# EAGLE schematic auto_band_pass_filter (EAGLE 9.6.2)
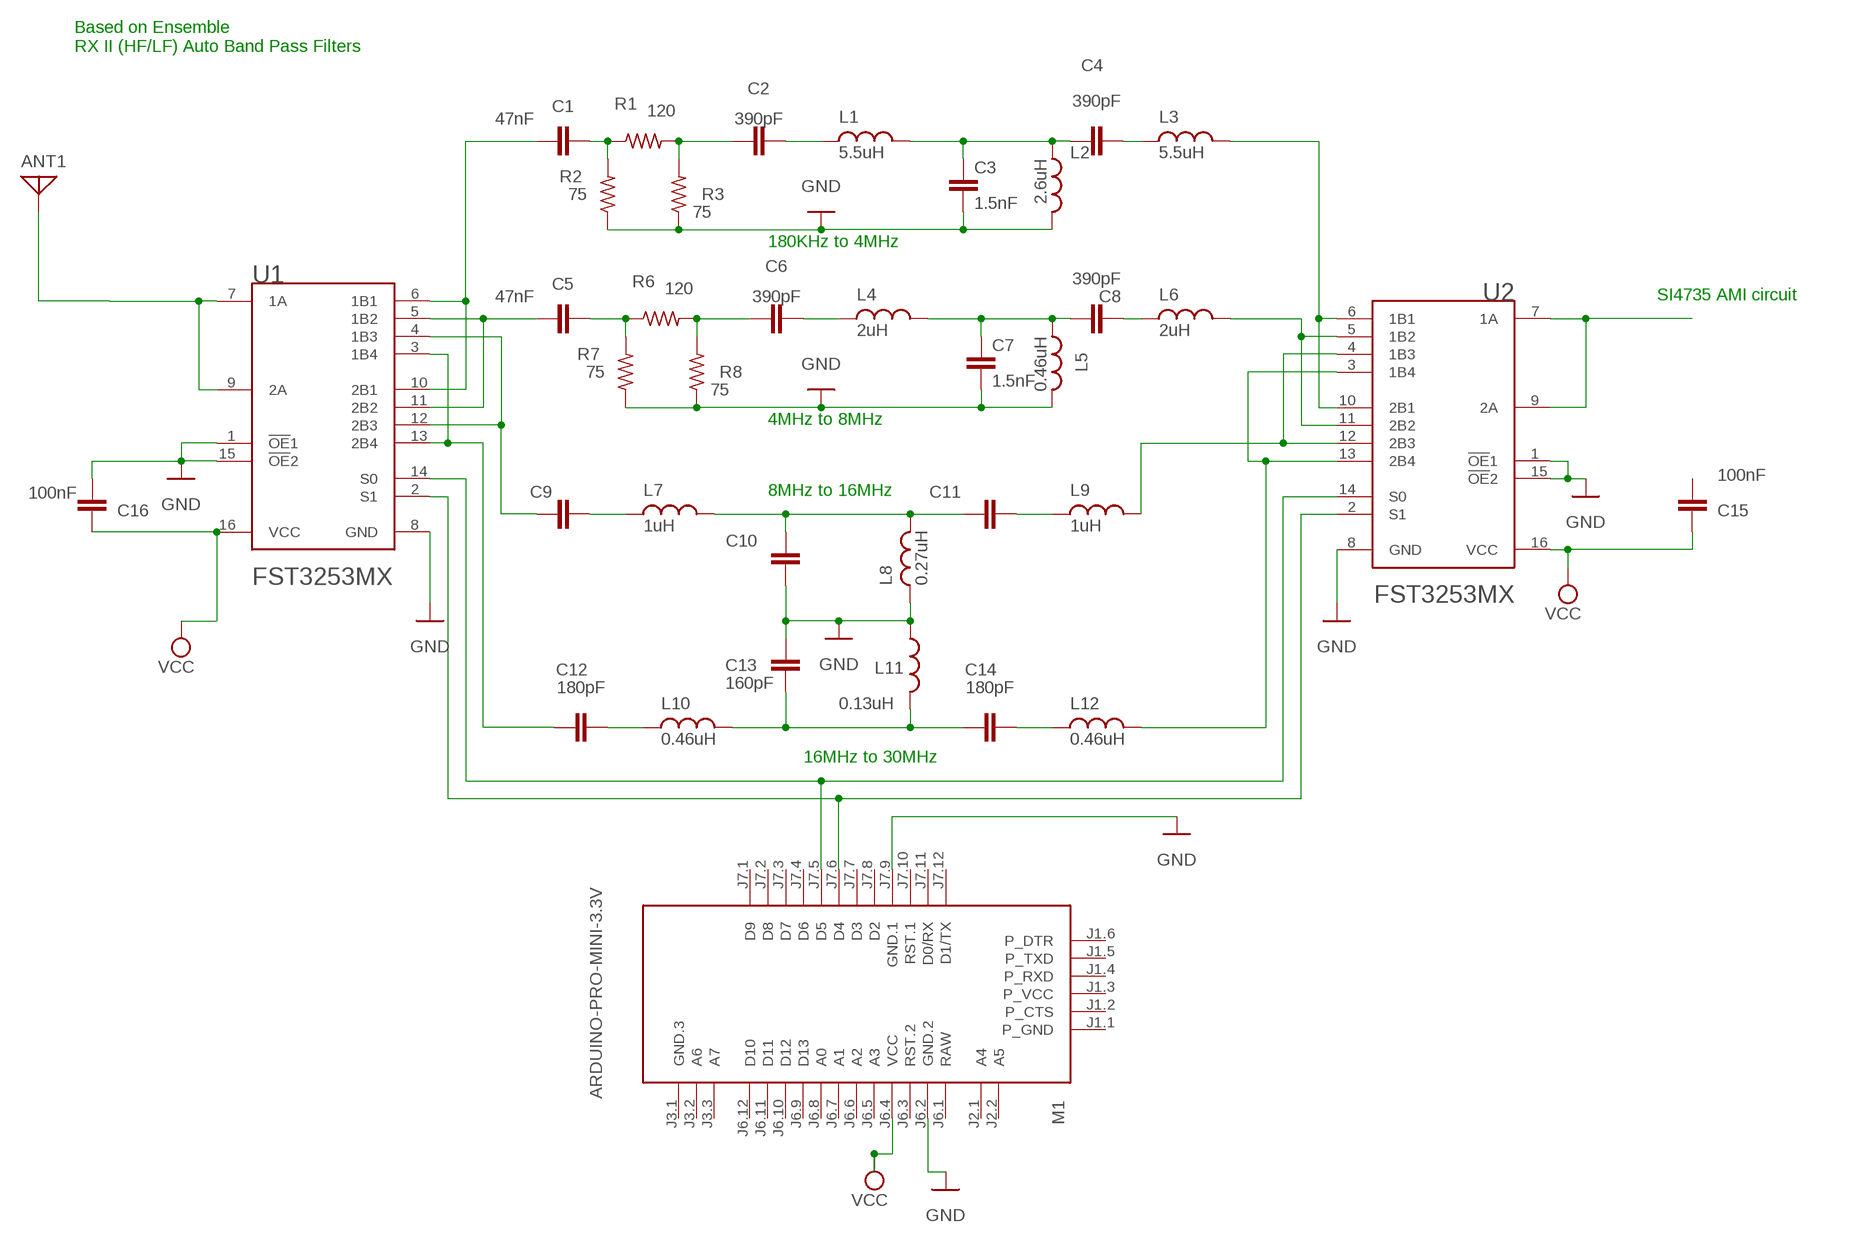
[diagram p0: schematic, sheet 1]

## Parts
ANT1  ANTENNA  [PAD-01]
C1  47nF  C2,5-3  [C2.5-3]
C2  390pF  C2,5-3  [C2.5-3]
C3  1.5nF  C2,5-3  [C2.5-3]
C4  390pF  C2,5-3  [C2.5-3]
C5  47nF  C2,5-3  [C2.5-3]
C6  390pF  C2,5-3  [C2.5-3]
C7  1.5nF  C2,5-3  [C2.5-3]
C8  390pF  C2,5-3  [C2.5-3]
C9  C2,5-3  [C2.5-3]
C10  C2,5-3  [C2.5-3]
C11  C2,5-3  [C2.5-3]
C12  180pF  C2,5-3  [C2.5-3]
C13  160pF  C2,5-3  [C2.5-3]
C14  180pF  C2,5-3  [C2.5-3]
C15  100nF  C2,5-3  [C2.5-3]
C16  100nF  C2,5-3  [C2.5-3]
L1  5.5uH  L  (no package)
L2  2.6uH  L  (no package)
L3  5.5uH  L  (no package)
L4  2uH  L  (no package)
L5  0.46uH  L  (no package)
L6  2uH  L  (no package)
L7  1uH  L  (no package)
L8  0.27uH  L  (no package)
L9  1uH  L  (no package)
L10  0.46uH  L  (no package)
L11  0.13uH  L  (no package)
L12  0.46uH  L  (no package)
M1  ARDUINO-PRO-MINI-3.3V  [ARDUINO-PRO-MINI]
R1  120  R-US_AXIAL-7.2MM-PITCH  [RESAD724W46L381D178B]
R2  75  R-US_AXIAL-7.2MM-PITCH  [RESAD724W46L381D178B]
R3  75  R-US_AXIAL-7.2MM-PITCH  [RESAD724W46L381D178B]
R6  120  R-US_AXIAL-7.2MM-PITCH  [RESAD724W46L381D178B]
R7  75  R-US_AXIAL-7.2MM-PITCH  [RESAD724W46L381D178B]
R8  75  R-US_AXIAL-7.2MM-PITCH  [RESAD724W46L381D178B]
U1  FAIRCHILD_FST3253MXFAIRCHILD_FST3253MX_0_0  [FAIRCHILD_FST3253MX_0]
U2  FAIRCHILD_FST3253MXFAIRCHILD_FST3253MX_0_0  [FAIRCHILD_FST3253MX_0]

## Nets
GND: C3.2 C7.2 C10.1 C13.1 C16.2 L2.2 L5.2 L8.1 L11.1 M1.J6.2(GND.2) M1.J7.9(GND.1) R2.1 R3.1 R7.1 R8.1 U1.1(!OE!1) U1.8(GND) U1.15(!OE!2) U2.1(!OE!1) U2.8(GND) U2.15(!OE!2)
N$1: C1.1 U1.6(1B1) U1.10(2B1)
N$2: C9.2 L7.1
N$3: C3.1 C4.1 L1.2 L2.1
N$4: C10.2 C11.1 L7.2 L8.2
N$5: C13.2 C14.1 L10.2 L11.2
N$6: C5.1 U1.5(1B2) U1.11(2B2)
N$7: C1.2 R1.1 R2.2
N$8: C2.1 R1.2 R3.2
N$9: C2.2 L1.1
N$10: C12.2 L10.1
N$11: C4.2 L3.1
N$12: C11.2 L9.1
N$13: C7.1 C8.1 L4.2 L5.1
N$14: C9.1 U1.4(1B3) U1.12(2B3)
N$15: M1.J7.5(D5) U1.14(S0) U2.14(S0)
N$16: C14.2 L12.1
N$17: C5.2 R6.1 R7.2
N$18: C6.1 R6.2 R8.2
N$19: M1.J7.6(D4) U1.2(S1) U2.2(S1)
N$20: ANT1.1 U1.7(1A) U1.9(2A)
N$21: L6.2 U2.5(1B2) U2.11(2B2)
N$22: C12.1 U1.3(1B4) U1.13(2B4)
N$23: L3.2 U2.6(1B1) U2.10(2B1)
N$24: U2.7(1A) U2.9(2A)
N$26: C6.2 L4.1
N$27: L9.2 U2.4(1B3) U2.12(2B3)
N$28: C8.2 L6.1
N$29: L12.2 U2.3(1B4) U2.13(2B4)
VCC: C15.1 C16.1 M1.J6.4(VCC) U1.16(VCC) U2.16(VCC)
Unconnected: C15.2 M1.J1.1(P_GND) M1.J1.2(P_CTS) M1.J1.3(P_VCC) M1.J1.4(P_RXD) M1.J1.5(P_TXD) M1.J1.6(P_DTR) M1.J2.1(A4) M1.J2.2(A5) M1.J3.1(GND.3) M1.J3.2(A6) M1.J3.3(A7) M1.J6.3(RST.2) M1.J6.5(A3) M1.J6.6(A2) M1.J6.7(A1) M1.J6.8(A0) M1.J6.9(D13) M1.J6.10(D12) M1.J6.11(D11) M1.J6.12(D10) M1.J7.1(D9) M1.J7.2(D8) M1.J7.3(D7) M1.J7.4(D6) M1.J7.7(D3) M1.J7.8(D2) M1.J7.10(RST.1) M1.J7.11(D0/RX) M1.J7.12(D1/TX)

## Notes on the sheet
- Based on Ensemble 
  RX II (HF/LF) Auto Band Pass Filters
- 180KHz to 4MHz
- SI4735 AMI circuit
- 4MHz to 8MHz
- 8MHz to 16MHz
- 16MHz to 30MHz

## Power pins joined to a net without a drawn wire
RAW: M1.J6.1(RAW)

## Library data of the parts
ANT1 = discrete:ANTENNA: Antenna
C1-C16 = capacitor-wima:C: CAPACITOR naming: grid - package width
L1-L12 = ngspice-simulation:L: INDUCTOR
M1 = diy-modules:ARDUINO-PRO-MINI-*: Arduino Pro Mini and compatible devices More details available here: https://www.arduino.cc/en/Main/ArduinoBoardProMini Click here to find device on ebay.com <http://www.ebay.com/sch/arduino+pro+mini>
R1-R3 R6-R8 = Resistor:R-US: Resistor Fixed - ANSI; CATEGORY: Resistor; SUB-CATEGORY: Fixed
U1 U2 = FST3253MX:FAIRCHILD_FST3253MX: Dual 4:1 Multiplexer/Demultiplexer Bus Switch; CENTROID_NOT_SPECIFIED: No; DATASHEET: https://upverter.com/datasheet/f853b4e0863e851c55c5a778b08fc07fa398812a.pdf; DIGIKEY_DESCRIPTION: IC MUX/DEMUX DUAL 4:1 TTL 16SOIC; DIGIKEY_PART_NUMBER: FST3253MXFSTR-ND; IPC_LAND_PATTERN_NAME: SOIC127P600X155-16; LEAD_FREE: yes; MF: Fairchild; MOUSER_PART_NUMBER: 512-FST3253MX; MPN: FST3253MX; PACKAGE: SOIC16; PREFIX: U; ROHS: yes; TEMPERATURE_RANGE_HIGH: +85°C; TEMPERATURE_RANGE_LOW: -40°C; VOLTAGE: 4 to 5.5 V